# Altium schematic sheet Headers.SchDoc
size A4; SheetNumber: 6; SheetTotal: 6
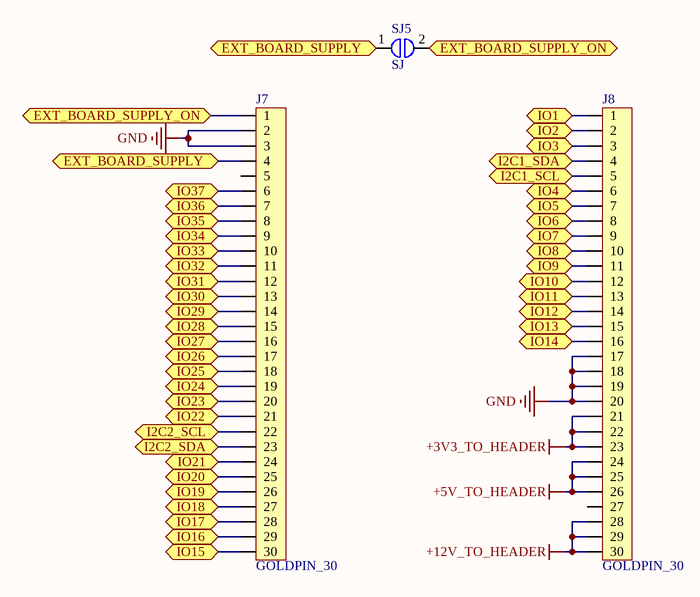
[diagram p0: Headers.SchDoc]

## Parts
J7  GOLDPIN_30  [PIN_HEADER_30_MALE]
J8  GOLDPIN_30  [PIN_HEADER_30_MALE]
SJ5  SJ  [SJ]

## Ports
EXT_BOARD_SUPPLY (bidir), EXT_BOARD_SUPPLY_ON (bidir), I2C1_SCL (bidir), I2C1_SDA (bidir), I2C2_SCL (bidir), I2C2_SDA (bidir), IO1 (bidir), IO2 (bidir), IO3 (bidir), IO4 (bidir), IO5 (bidir), IO6 (bidir), IO7 (bidir), IO8 (bidir), IO9 (bidir), IO10 (bidir), IO11 (bidir), IO12 (bidir), IO13 (bidir), IO14 (bidir), IO15 (bidir), IO16 (bidir), IO17 (bidir), IO18 (bidir), IO19 (bidir), IO20 (bidir), IO21 (bidir), IO22 (bidir), IO23 (bidir), IO24 (bidir), IO25 (bidir), IO26 (bidir), IO27 (bidir), IO28 (bidir), IO29 (bidir), IO30 (bidir), IO31 (bidir), IO32 (bidir), IO33 (bidir), IO34 (bidir), IO35 (bidir), IO36 (bidir), IO37 (bidir)

## Nets
+3V3_TO_HEADER: J8.21 J8.22 J8.23
+5V_TO_HEADER: J8.24 J8.25 J8.26
+12V_TO_HEADER: J8.28 J8.29 J8.30
GND: J7.2 J7.3 J8.17 J8.18 J8.19 J8.20
EXT_BOARD_SUPPLY: J7.4 SJ5.1 ; port EXT_BOARD_SUPPLY
EXT_BOARD_SUPPLY_ON: J7.1 SJ5.2 ; port EXT_BOARD_SUPPLY_ON
I2C1_SCL: J8.5 ; port I2C1_SCL
I2C1_SDA: J8.4 ; port I2C1_SDA
I2C2_SCL: J7.22 ; port I2C2_SCL
I2C2_SDA: J7.23 ; port I2C2_SDA
IO1: J8.1 ; port IO1
IO2: J8.2 ; port IO2
IO3: J8.3 ; port IO3
IO4: J8.6 ; port IO4
IO5: J8.7 ; port IO5
IO6: J8.8 ; port IO6
IO7: J8.9 ; port IO7
IO8: J8.10 ; port IO8
IO9: J8.11 ; port IO9
IO10: J8.12 ; port IO10
IO11: J8.13 ; port IO11
IO12: J8.14 ; port IO12
IO13: J8.15 ; port IO13
IO14: J8.16 ; port IO14
IO15: J7.30 ; port IO15
IO16: J7.29 ; port IO16
IO17: J7.28 ; port IO17
IO18: J7.27 ; port IO18
IO19: J7.26 ; port IO19
IO20: J7.25 ; port IO20
IO21: J7.24 ; port IO21
IO22: J7.21 ; port IO22
IO23: J7.20 ; port IO23
IO24: J7.19 ; port IO24
IO25: J7.18 ; port IO25
IO26: J7.17 ; port IO26
IO27: J7.16 ; port IO27
IO28: J7.15 ; port IO28
IO29: J7.14 ; port IO29
IO30: J7.13 ; port IO30
IO31: J7.12 ; port IO31
IO32: J7.11 ; port IO32
IO33: J7.10 ; port IO33
IO34: J7.9 ; port IO34
IO35: J7.8 ; port IO35
IO36: J7.7 ; port IO36
IO37: J7.6 ; port IO37

Not connected (* = marked no-connect by the designer): J7 5; J8 27